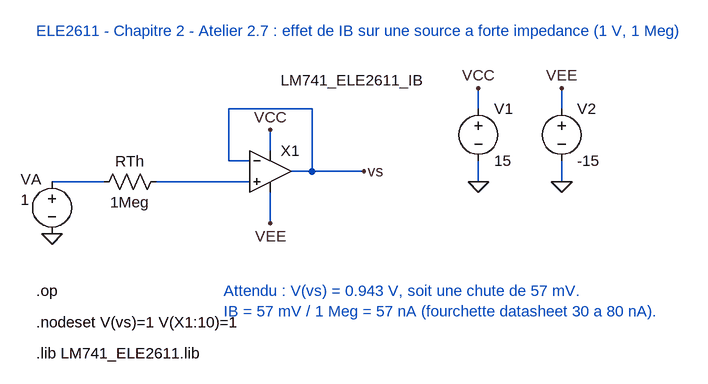
[diagram p0: schematic Ch2_Atelier_2_7_IB.asc]
Ch2_Atelier_2_7_IB.asc, the LTspice schematic file:
Version 4
SHEET 1 1200 700
WIRE 464 256 496 256
WIRE 496 160 496 256
WIRE 368 160 496 160
WIRE 368 160 368 240
WIRE 368 240 400 240
WIRE 432 192 432 224
WIRE 432 288 432 336
WIRE 496 256 576 256
WIRE 96 272 176 272
WIRE 256 272 400 272
WIRE 752 128 752 160
WIRE 752 240 752 272
WIRE 880 128 880 160
WIRE 880 240 880 272
FLAG 432 192 VCC
FLAG 432 336 VEE
FLAG 576 256 vs
FLAG 96 352 0
FLAG 752 128 VCC
FLAG 752 272 0
FLAG 880 128 VEE
FLAG 880 272 0
SYMBOL Opamps\\opamp2 432 192 R0
WINDOW 3 16 -76 Left 2
SYMATTR InstName X1
SYMATTR Value LM741_ELE2611_IB
SYMBOL voltage 96 256 R0
WINDOW 0 -48 12 Left 2
WINDOW 3 -48 44 Left 2
SYMATTR InstName VA
SYMATTR Value 1
SYMBOL res 272 256 R90
WINDOW 0 0 56 VBottom 2
WINDOW 3 32 56 VTop 2
SYMATTR InstName RTh
SYMATTR Value 1Meg
SYMBOL voltage 752 144 R0
SYMATTR InstName V1
SYMATTR Value 15
SYMBOL voltage 880 144 R0
SYMATTR InstName V2
SYMATTR Value -15
TEXT 72 40 Left 2 ;ELE2611 - Chapitre 2 - Atelier 2.7 : effet de IB sur une source a forte impedance (1 V, 1 Meg)
TEXT 72 440 Left 2 !.op
TEXT 72 488 Left 2 !.nodeset V(vs)=1 V(X1:10)=1
TEXT 72 536 Left 2 !.lib LM741_ELE2611.lib
TEXT 360 440 Left 2 ;Attendu : V(vs) = 0.943 V, soit une chute de 57 mV.\nIB = 57 mV / 1 Meg = 57 nA (fourchette datasheet 30 a 80 nA).

The netlist it stands for:
* Ch2_Atelier_2_7_IB.asc
XX1 N002 vs VCC VEE vs LM741_ELE2611_IB  ; pins In+ In- V+ V- OUT
VA N001 0 1
RTh N002 N001 1Meg
V1 VCC 0 15
V2 VEE 0 -15
* ELE2611 - Chapitre 2 - Atelier 2.7 : effet de IB sur une source a forte impedance (1 V, 1 Meg)
.op
.nodeset V(vs)=1 V(X1:10)=1
.lib LM741_ELE2611.lib
* Attendu : V(vs) = 0.943 V, soit une chute de 57 mV.
* IB = 57 mV / 1 Meg = 57 nA (fourchette datasheet 30 a 80 nA).
.backanno
.end